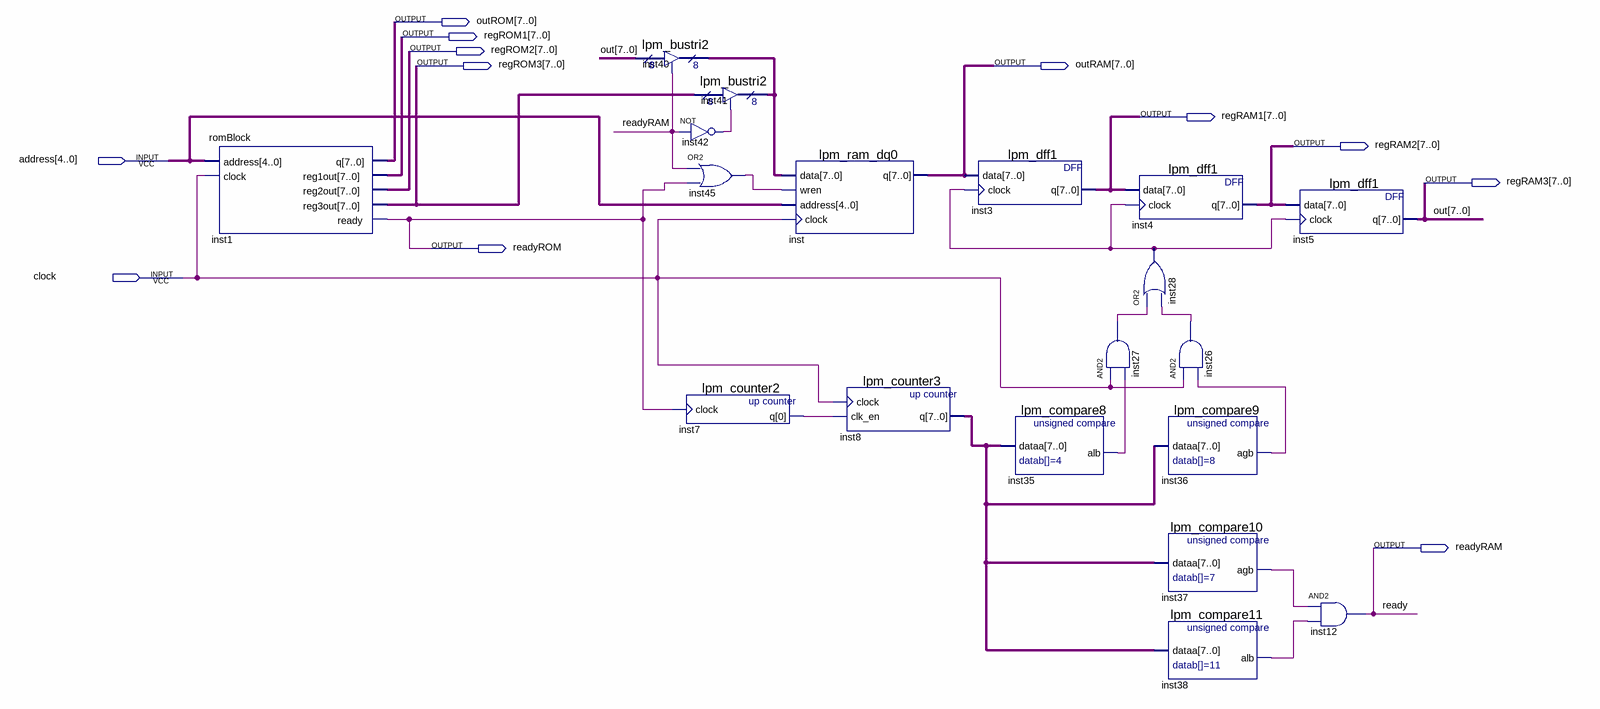
[diagram p0: schematic sheet]
// Quartus schematic rom_RAM.bdf as structural Verilog: 19 symbols, 12 pins
module rom_RAM (
  input  [4:0] address,
  input  clock,
  output [7:0] outROM,
  output [7:0] regROM1,
  output [7:0] regROM2,
  output [7:0] regROM3,
  output [7:0] outRAM,
  output [7:0] regRAM1,
  output [7:0] regRAM2,
  output [7:0] regRAM3,
  output readyROM,
  output readyRAM
);

  wire inst7_q, inst26_out, inst27_out, inst28_out, inst35_alb, inst36_agb, inst37_agb, inst38_alb,
       inst42_out, inst45_out;
  wire [7:0] inst8_q, inst40_tridata;

  romBlock inst1 (
    .address(address), .clock(clock), .q(outROM), .reg1out(regROM1), .reg2out(regROM2), .reg3out(regROM3),
    .ready(readyROM));
  lpm_bustri2 inst40 (.enabledt(readyRAM), .data(regRAM3), .tridata(inst40_tridata));
  lpm_bustri2 inst41 (.enabledt(inst42_out), .data(regROM3), .tridata(inst40_tridata));
  not inst42 (inst42_out, readyRAM);
  or inst45 (inst45_out, readyRAM, readyROM);
  lpm_counter2 inst7 (.clock(readyROM), .q(inst7_q));
  lpm_ram_dq0 inst (.data(inst40_tridata), .wren(inst45_out), .address(address), .clock(clock), .q(outRAM));
  lpm_counter3 inst8 (.clock(clock), .clk_en(inst7_q), .q(inst8_q));
  lpm_dff1 inst3 (.data(outRAM), .clock(inst28_out), .q(regRAM1));
  lpm_compare8 inst35 (.dataa(inst8_q), .alb(inst35_alb));
  lpm_dff1 inst4 (.data(regRAM1), .clock(inst28_out), .q(regRAM2));
  or inst28 (inst28_out, inst27_out, inst26_out);
  and inst27 (inst27_out, clock, inst35_alb);
  and inst26 (inst26_out, clock, inst36_agb);
  lpm_compare9 inst36 (.dataa(inst8_q), .agb(inst36_agb));
  lpm_compare10 inst37 (.dataa(inst8_q), .agb(inst37_agb));
  lpm_compare11 inst38 (.dataa(inst8_q), .alb(inst38_alb));
  lpm_dff1 inst5 (.data(regRAM2), .clock(inst28_out), .q(regRAM3));
  and inst12 (readyRAM, inst37_agb, inst38_alb);

  // Other names for the same wires on the sheet: ready = readyRAM; out[7:0] = regRAM3
endmodule
